# EAGLE design MainBoard 1.5.1 (EAGLE 9.6.2)
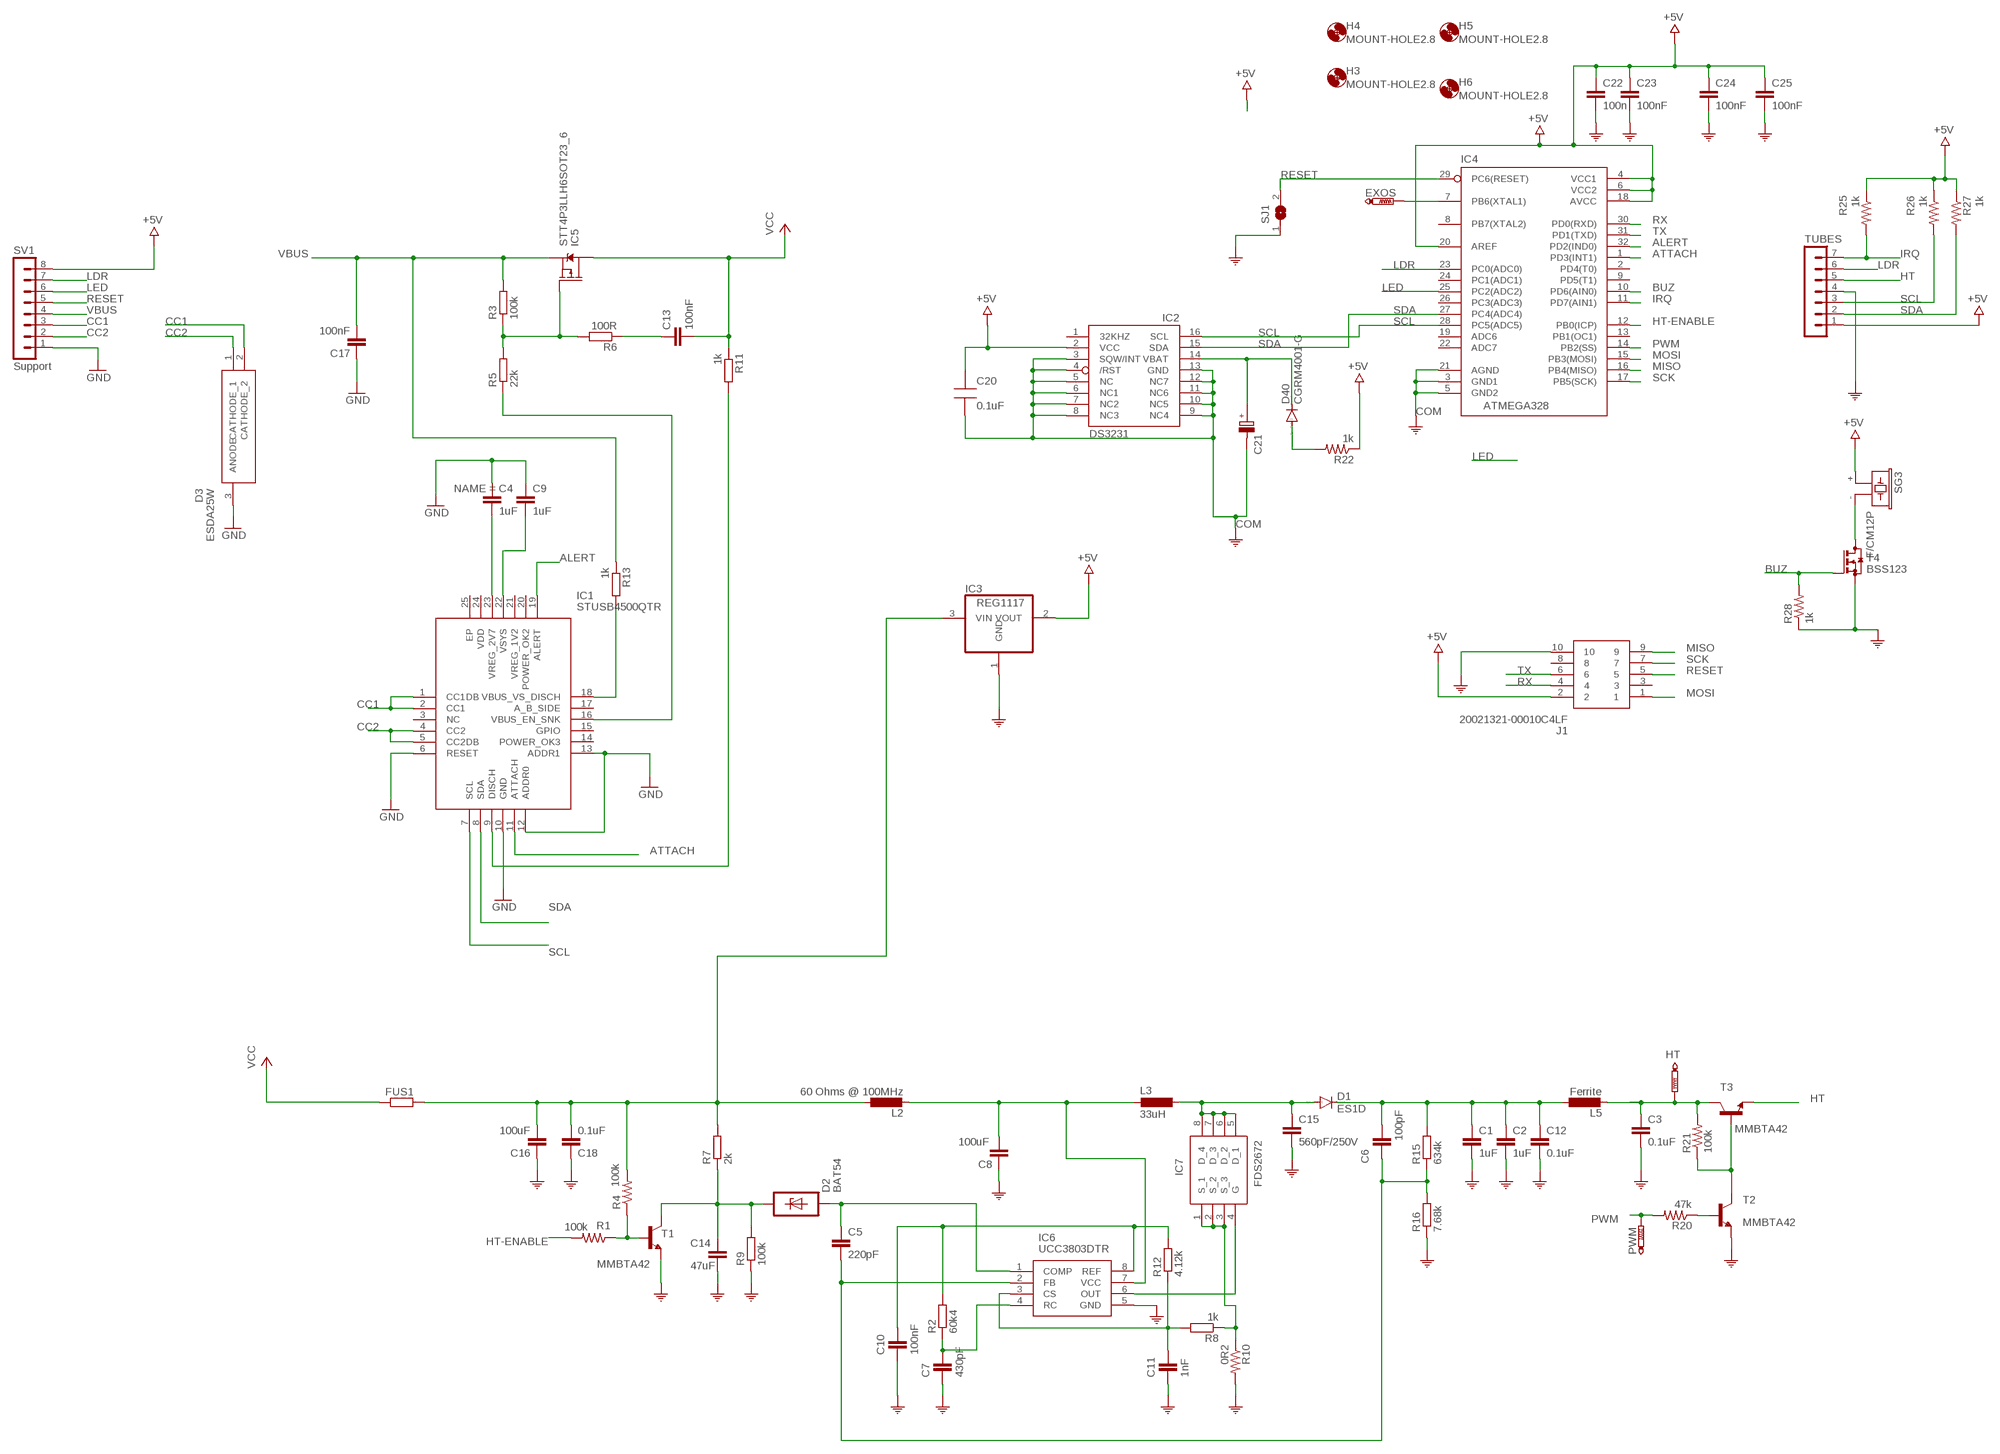
[diagram p0: schematic, sheet 1]

## Parts
C1  1uF  C-EUC1812K  [C1812K]
C2  1uF  C-EUC1812K  [C1812K]
C3  0.1uF  C-EUC1808  [C1808]
C4  1uF  C-EUC0603  [C0603]
C5  220pF  C-EUC0805K  [C0805K]
C6  100pF  C-EUC0805  [C0805]
C7  430pF  C-EUC0805  [C0805]
C8  100uF  C-EUC1210  [C1210]
C9  1uF  C-EUC0603  [C0603]
C10  100nF  C-EUC0805  [C0805]
C11  1nF  C-EUC0805  [C0805]
C12  0.1uF  C-EUC1808  [C1808]
C13  100nF  C-EUC0402  [C0402]
C14  47uF  C-EUC1210  [C1210]
C15  560pF/250V  C-EUC0603  [C0603]
C16  100uF  C-EUC1210  [C1210]
C17  100nF  C-EUC0402  [C0402]
C18  0.1uF  C-EUC0805  [C0805]
C20  0.1uF  CAP0805-NP  [CAP0805-NP]
C21  AHG-35/100-RADIAL  [ELNA21.5X8.0]
C22  100n  C-EUC0603  [C0603]
C23  100nF  C-EUC0603  [C0603]
C24  100nF  C-EUC0603  [C0603]
C25  100nF  C-EUC0603  [C0603]
D1  ES1D  ES2D  [SMB]
D2  BAT54  SP4020-01FTG  [SOD323]
D3  ESDA25W  [SOT65P210X110-3N]
D40  CGRM4001-G  [SOD-123_MINI-SMA]
EXOS  PTR1TP09R  [TP09R]
FUS1  R-EU_R6332  [R6332]
H3  MOUNT-HOLE2.8  [2,8]
H4  MOUNT-HOLE2.8  [2,8]
H5  MOUNT-HOLE2.8  [2,8]
H6  MOUNT-HOLE2.8  [2,8]
HT  PTR1TP09R  [TP09R]
IC1  STUSB4500QTR  [QFN50P400X400X100-25N]
IC2  DS3231/SO  [SO16W]
IC3  REG1117  [SOT223]
IC4  ATMEGA328  ATMEGA168-20AU  [QFP032]
IC5  STT4P3LLH6SOT23_6  [SOT23-6]
IC6  UCC3803DTR  [SOIC127P600X175-8N]
IC7  FDS2672  [SOIC127P600X175-8N]
J1  20021321-00010C4LF  [2002132100010C4LF]
L2  60 Ohms @ 100MHz  L-EUL2012C  [L2012C]
L3  33uH  MSS7341  [MSS7341]
L5  Ferrite  L-EUL2012C  [L2012C]
PWM  PTR1TP09R  [TP09R]
R1  100k  R-US_R0805  [R0805]
R2  60k4  R-EU_R0805  [R0805]
R3  100k  R-EU_R0805  [R0805]
R4  100k  R-US_R0805  [R0805]
R5  22k  R-EU_R0805  [R0805]
R6  100R  R-EU_R0805  [R0805]
R7  2k  R-EU_R0805  [R0805]
R8  1k  R-EU_R0805  [R0805]
R9  100k  R-EU_R0805  [R0805]
R10  0R2  R-US_R2010  [R2010]
R11  1k  R-EU_R0805  [R0805]
R12  4.12k  R-EU_R0805  [R0805]
R13  1k  R-EU_R0805  [R0805]
R15  634k  R-EU_R0805  [R0805]
R16  7.68k  R-EU_R0805  [R0805]
R20  47k  R-US_R2012  [R2012]
R21  100k  R-US_R2012  [R2012]
R22  1k  R-US_M2012  [M2012]
R25  1k  R-US_M2012  [M2012]
R26  1k  R-US_M2012  [M2012]
R27  1k  R-US_M2012  [M2012]
R28  1k  R-US_M2012  [M2012]
SG3  F/CM12P  [F/CM12P]
SJ1  SJW  [SJW]
SV1  Support  MA08-1  [MA08-1]
T1  MMBTA42  BC846  [SOT23]
T2  MMBTA42  BC846  [SOT23]
T3  MMBTA42  BC846  [SOT23]
T4  BSS123  [SOT23]
TUBES  MA07-1  [MA07-1]

## Nets
+5V [pwr]: C20.1 C22.1 C23.1 C24.1 C25.1 IC2.2(VCC) IC3.2(VOUT) IC4.4(VCC1) IC4.6(VCC2) IC4.18(AVCC) IC4.20(AREF) J1.2 R22.1 R25.1 R26.1 R27.1 SG3.+ SV1.8 TUBES.1
ALERT: IC1.19(ALERT) IC4.32(PD2(IND0))
ATTACH: IC1.11(ATTACH) IC4.1(PD3(INT1))
BATT: C21.+ D40.C IC2.14(VBAT)
BUZ: IC4.10(PD6(AIN0)) R28.2 T4.1(G)
CC1: D3.2(CATHODE_2) IC1.1(CC1DB) IC1.2(CC1) SV1.3
CC2: D3.1(CATHODE_1) IC1.4(CC2) IC1.5(CC2DB) SV1.2
COM: C1.2 C2.2 C3.2 C4.1 C7.2 C8.1 C9.1 C10.2 C11.2 C12.2 C14.2 C15.2 C16.1 C17.1 C18.2 C20.2 C21.- C22.2 C23.2 C24.2 C25.2 D3.3(ANODE) IC1.6(RESET) IC1.10(GND) IC1.12(ADDR0) IC1.13(ADDR1) IC2.3(SQW/INT) IC2.4(/RST) IC2.5(NC) IC2.6(NC1) IC2.7(NC2) IC2.8(NC3) IC2.9(NC4) IC2.10(NC5) IC2.11(NC6) IC2.12(NC7) IC2.13(GND) IC3.1(GND) IC4.3(GND1) IC4.5(GND2) IC4.21(AGND) IC6.5(GND) J1.10 R9.1 R10.2 R16.1 R28.1 SJ1.1 SV1.1 T1.2(E) T2.2(E) T4.2(S) TUBES.4 ; supply symbol labelled GND
CS: C11.1 IC6.3(CS) R8.2 R12.1
FB: C5.2 C6.2 IC6.2(FB) R15.1 R16.2
HT: T3.2(E) TUBES.5
HT-ENABLE: IC4.12(PB0(ICP)) R1.2
IRQ: IC4.11(PD7(AIN1)) R25.2 TUBES.7
LDR: IC4.23(PC0(ADC0)) SV1.7 TUBES.6
LED: IC4.25(PC2(ADC2)) SV1.6
MISO: IC4.16(PB4(MISO)) J1.9
MOSI: IC4.15(PB3(MOSI)) J1.1
N$1: C4.2 IC1.23(VREG_2V7)
N$2: C9.2 IC1.22(VSYS)
N$3: SG3.- T4.3(D)
N$5: EXOS.TP IC4.7(PB6(XTAL1))
N$6: C1.1 C2.1 C6.1 C12.1 D1.C L5.1 R15.2
N$7: R21.1 T2.3(C) T3.1(B)
N$8: R1.1 R4.1 T1.1(B)
N$9: C14.1 D2.C R7.1 R9.2 T1.3(C)
N$10: C5.1 D2.A IC6.1(COMP)
N$11: IC5.3(G) R3.1 R5.2 R6.2
N$12: IC7.1(S_1) IC7.2(S_2) IC7.3(S_3) R8.1 R10.1
N$13: C13.1 R6.1
N$14: C8.2 IC6.7(VCC) L2.2 L3.1
N$17: IC1.16(VBUS_EN_SNK) R5.1
N$18: C15.1 D1.A IC7.5(D_1) IC7.6(D_2) IC7.7(D_3) IC7.8(D_4) L3.2
N$19: R20.1 T2.1(B)
N$21: IC1.9(DISCH) R11.2
N$22: IC1.18(VBUS_VS_DISCH) R13.2
N$23: D40.A R22.2
OUT: IC6.6(OUT) IC7.4(G)
POSTFUSE [pwr]: C16.2 C18.1 FUS1.2 IC3.3(VIN) L2.1 R4.2 R7.2
PWM: IC4.14(PB2(SS)) PWM.TP R20.2
RAW_HT: C3.1 HT.TP L5.2 R21.2 T3.3(C)
RC: C7.1 IC6.4(RC) R2.1
REF: C10.1 IC6.8(REF) R2.2 R12.2
RESET: IC4.29(PC6(RESET)) J1.5 SJ1.2 SV1.5
RX: IC4.30(PD0(RXD)) J1.4
SCK: IC4.17(PB5(SCK)) J1.7
SCL: IC1.7(SCL) IC2.16(SCL) IC4.28(PC5(ADC5)) R26.2 TUBES.3
SDA: IC1.8(SDA) IC2.15(SDA) IC4.27(PC4(ADC4)) R27.2 TUBES.2
TX: IC4.31(PD1(TXD)) J1.6
VBUS: C17.2 IC5.4(S) R3.2 R13.1 SV1.4
VCC [pwr]: C13.2 FUS1.1 IC5.1(D) IC5.2(D) IC5.5(D) IC5.6(D) R11.1
Unconnected: IC1.3(NC) IC1.14(POWER_OK3) IC1.15(GPIO) IC1.17(A_B_SIDE) IC1.20(POWER_OK2) IC1.21(VREG_1V2) IC1.24(VDD) IC1.25(EP) IC2.1(32KHZ) IC4.2(PD4(T0)) IC4.8(PB7(XTAL2)) IC4.9(PD5(T1)) IC4.13(PB1(OC1)) IC4.19(ADC6) IC4.22(ADC7) IC4.24(PC1(ADC1)) IC4.26(PC3(ADC3)) J1.3 J1.8

## Library data of the parts
C1 C2 = rcl:C-EU: CAPACITOR, European symbol; MOUSER: 810-C4532X7T2E105MST; SPICEPREFIX: C; TDK: C4532X7T2E105M250KE
C3 C12 = rcl:C-EU: CAPACITOR, European symbol; KEMET: CAN17C104KARACTU; MOUSER: 80-CAN17C104KARACTU; SPICEPREFIX: C
C4 = rcl:C-EU: CAPACITOR, European symbol; MOUSER_PART_NUMBER: 81-GRM155R61E105KA2D; SPICEPREFIX: C
C5 C9 C14 C15 C18 C22-C25 = rcl:C-EU: CAPACITOR, European symbol; SPICEPREFIX: C
C6 C7 C10 C11 = rcl:C-EU: CAPACITOR, European symbol; MOUSER: 791-0603X106K100CT; SPICEPREFIX: C
C8 C16 = rcl:C-EU: CAPACITOR, European symbol; MOUSER: 963-EMK325ABJ107MM-P; SPICEPREFIX: C; TAIYO_YUDEN: EMK325ABJ107MM-P
C13 C17 = rcl:C-EU: CAPACITOR, European symbol; MOUSER_PART_NUMBER: 710-885012205050; SPICEPREFIX: C
C20 = MySMD:CAP0805-NP
C21 = Elkos:AHG-35/100-RADIAL: AUDYN® - AHG Gepolt, radial High Grade AHG Gepolter Elekrolytkondensator für Audio-Netzteile, oder Verstärker im Home- und Car-Bereich. Technische Daten Anschlußdrähte: Kupfer, verzinnt AL: ? mm d2ø : ? mm Kapazitätsbereich: von 10 µF bis 2200 µF Nennspannungen: 25 V, 35 V, 50 V, 100 V C-Toleranz: 20 % ( bei 20° C ) Verlustfaktor: tan δ < 0,100 @ 1 kHz Temperaturbereich: - 40° C bis 85° C Verzerrung: sehr gering bei 10 kHz, 010 A - 120 dB oder niedriger gepolt AHG AUDYN® - AHG gepolt Bezeichnung C U DxH Rm Bestell.-Nr. U / Volt D x L/mm mm AHG/10.0/100V 10µF 100V 10x15 5,0 1341690 AHG/22.0/50V 22µF 50V 10x13 5,0 1341691 AHG/47.0/50V 47µF 50V 10x16 5,0 1341692 AHG/100.0/50V 100µF 50V 13x21 5,0 1341693 AHG/220.0/50V 220µF 50V 16x25 7,5 1341694 AHG/470.0/50V 470µF 50V 16x37 7,5 1341695 AHG/1000/35V 1000µF 35V 18x37 7,5 1341696 AHG/2200/35V 2200µF 35V 22x38 10,0 1341697 Alle Abmessungen in mm; MOUSER: 555-DB-5R5D474T
D1 = diode:ES2D: DIODE super fast rectifier, 2 A
D2 = sp4020_11:SP4020-01FTG: SP4020 Series 2.5pF, 30A Discrete TVS Diode Source: http://www.littelfuse.com/~/media/electronics/datasheets/tvs_diode_arrays/littelfuse_tvs_diode_array_sp4020_datasheet.pdf.pdf; MF: Littelfuse; MPN: SP4020-01FTG; OC_FARNELL: unknown; OC_NEWARK: 05X0400
D3 = SamacSys_Parts:ESDA25W: STMicroelectronics ESDA25W Dual Uni-Directional TVS Diode Array, 400W peak, 3-Pin SOT-323 Source: Datasheet <https://componentsearchengine.com/Datasheets/1/ESDA25W.pdf>; DESCRIPTION: STMicroelectronics ESDA25W Dual Uni-Directional TVS Diode Array, 400W peak, 3-Pin SOT-323; HEIGHT: 1.1mm; MANUFACTURER_NAME: STMicroelectronics; MANUFACTURER_PART_NUMBER: ESDA25W; MOUSER_PART_NUMBER: 511-ESDA25W; MOUSER_PRICE-STOCK: https://www.mouser.com/Search/Refine.aspx?Keyword=511-ESDA25W
D40 = diode:CGRM400*-G: Molded plasitc,JEDEC SOD-123/Mini SMA Source: Comchip CGRM4001-G.pdf; MOUSER: 863-NSR0320MW2T1G
EXOS HT PWM = testpad:PTR1: TEST PIN
FUS1 = rcl:R-EU_: RESISTOR, European symbol; MOUSER: 530-0ZCG0150AF2C; SPICEPREFIX: R
H3-H6 = holes:MOUNT-HOLE: MOUNTING HOLE with drill center marker
IC1 = SamacSys_Parts:STUSB4500QTR: USB Interface IC CONDITIONING & INTERFACES Source: Datasheet <https://componentsearchengine.com/Datasheets/1/STUSB4500QTR.pdf>; DESCRIPTION: USB Interface IC CONDITIONING & INTERFACES; HEIGHT: 1mm; MANUFACTURER_NAME: STMicroelectronics; MANUFACTURER_PART_NUMBER: STUSB4500QTR; MOUSER_PART_NUMBER: 511-STUSB4500QTR; MOUSER_PRICE-STOCK: https://www.mouser.com/Search/Refine.aspx?Keyword=511-STUSB4500QTR
IC2 = DS3231:DS3231; AVAILABILITY: Unavailable; MF: Maxim Integrated; MP: DS3231; PACKAGE: SOIC-16 Maxim Integrated; PRICE: None
IC3 = burr-brown:REG1117: 800mA and 1A Low Dropout (LDO) Positive Regulator 1.8V, 2.5V, 2.85V, 3.3V, 5V, and Adj; MPN: REG1117; OC_FARNELL: 1097566; OC_NEWARK: 14P6981
IC4 = MySMD:ATMEGA168-20AU
IC5 = STT4P3LLH6:STT4P3LLH6; AVAILABILITY: Unavailable; DESCRIPTION: P-Channel 30 V, 0.048 Ohm typ., 4 A STripFET H6 Power MOSFET in a SOT23-6L package; MF: STMicroelectronics; MP: STT4P3LLH6; PACKAGE: SOT-23-6 STMicroelectronics; PRICE: None
IC6 = UCC3803DTR:UCC3803DTR: Switching Controllers Low-Power BiCMOS Current-Mode PWM Source: Datasheet <http://www.ti.com/lit/ds/symlink/ucc3803.pdf>; DESCRIPTION: Switching Controllers Low-Power BiCMOS Current-Mode PWM; HEIGHT: 1.75mm; MANUFACTURER_NAME: Texas Instruments; MANUFACTURER_PART_NUMBER: UCC3803DTR; MOUSER_PART_NUMBER: 595-UCC3803DTR; MOUSER_PRICE-STOCK: https://www.mouser.com/Search/Refine.aspx?Keyword=595-UCC3803DTR
IC7 = FDS2672:FDS2672: FDS2672, N-channel MOSFET Transistor 3.9 A 200 V, 8-Pin SOIC Source: Datasheet <http://docs-emea.rs-online.com/webdocs/0d23/0900766b80d23481.pdf>; DESCRIPTION: FDS2672, N-channel MOSFET Transistor 3.9 A 200 V, 8-Pin SOIC; HEIGHT: 1.75mm; MANUFACTURER_NAME: Fairchild Semiconductor; MANUFACTURER_PART_NUMBER: FDS2672; MOUSER_PART_NUMBER: 512-FDS2672; MOUSER_PRICE-STOCK: https://www.mouser.com/Search/Refine.aspx?Keyword=512-FDS2672; RS_PART_NUMBER: 6710481P; RS_PRICE-STOCK: http://uk.rs-online.com/web/p/products/6710481P
J1 = SamacSys_Parts:20021321-00010C4LF: Headers & Wire Housings 1.27x1.27mm BTB, Hdr Recept, SMT, 10 Pos Source: Datasheet <https://componentsearchengine.com/Datasheets/1/20021321-00010C4LF.pdf>; DESCRIPTION: Headers & Wire Housings 1.27x1.27mm BTB, Hdr Recept, SMT, 10 Pos; HEIGHT: 4.75mm; MANUFACTURER_NAME: Amphenol; MANUFACTURER_PART_NUMBER: 20021321-00010C4LF; MOUSER_PART_NUMBER: 649-202132100010C4LF; MOUSER_PRICE-STOCK: https://www.mouser.com/Search/Refine.aspx?Keyword=649-202132100010C4LF
L2 L5 = rcl:L-EU: INDUCTOR, European symbol; SPICEPREFIX: L
L3 = STEAM-inductor-coilcraft:MSS7341: Shielded Power Inductors Package 6.6 × 6.6 mm x 4.1 mm high Source: http://www.farnell.com/datasheets/1681958.pdf; MOUSER: 710-784770330
R1 R4 R10 R20-R22 R25-R28 = adafruit:R-US_: RESISTOR, American symbol
R2 R3 R5 R6 R8 R9 R11 R13 = rcl:R-EU_: RESISTOR, European symbol; SPICEPREFIX: R
R7 = rcl:R-EU_: RESISTOR, European symbol; MOUSER: 754-RR1220P-202D; SPICEPREFIX: R; SUSUMU: RR1220P-202-D
R12 = rcl:R-EU_: RESISTOR, European symbol; KOASPEER: RN732ATTD4121F100; MOUSER: 660-RN732ATD4121F100; SPICEPREFIX: R
R15 = rcl:R-EU_: RESISTOR, European symbol; MOUSER: 71-CRCW0603-634K-E3; SPICEPREFIX: R; VISHAY: CRCW0603634KFKEA
R16 = rcl:R-EU_: RESISTOR, European symbol; MOUSER: 71-CRCW0805-7.68K-E3; SPICEPREFIX: R; VISHAY: CRCW08057K68FKEA
SG3 = buzzer:F/CM12P: BUZZER Source: Buerklin; OC_FARNELL: unknown; OC_NEWARK: unknown
SJ1 = jumper:SJ: SMD solder JUMPER
SV1 = con-lstb:MA08-1: PIN HEADER; OC_FARNELL: unknown; OC_NEWARK: unknown
T1-T3 = transistor:BC846: NPN TRANSISTOR
T4 = transistor-small-signal:BSS123: N-CHANNEL MOS FET
TUBES = con-lstb:MA07-1: PIN HEADER; OC_FARNELL: unknown; OC_NEWARK: unknown

## Module TUBEIN16
Ports: 

### Library data of the parts

## Net classes
0 default: width 0.254 mm, clearance 0.254 mm
1 pwr: width 0.254 mm, clearance 0.356 mm

## Board
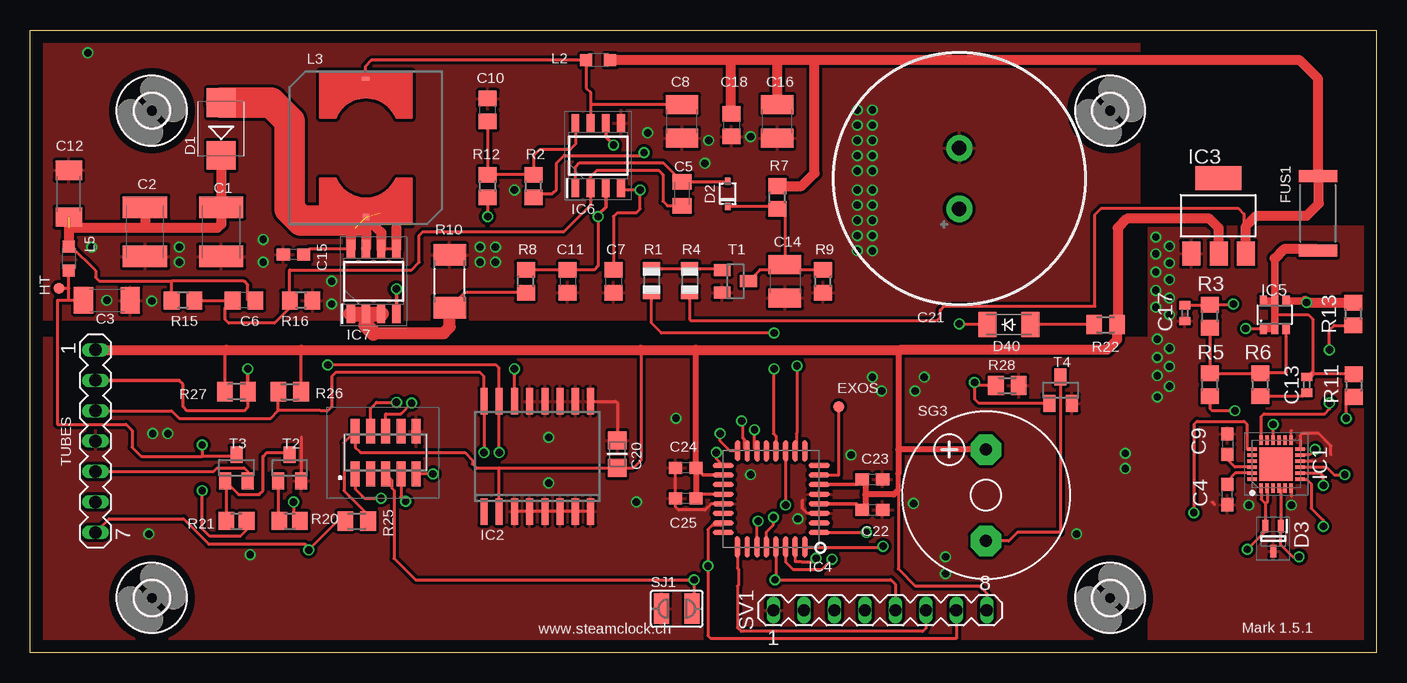
[diagram p1: board, top side]
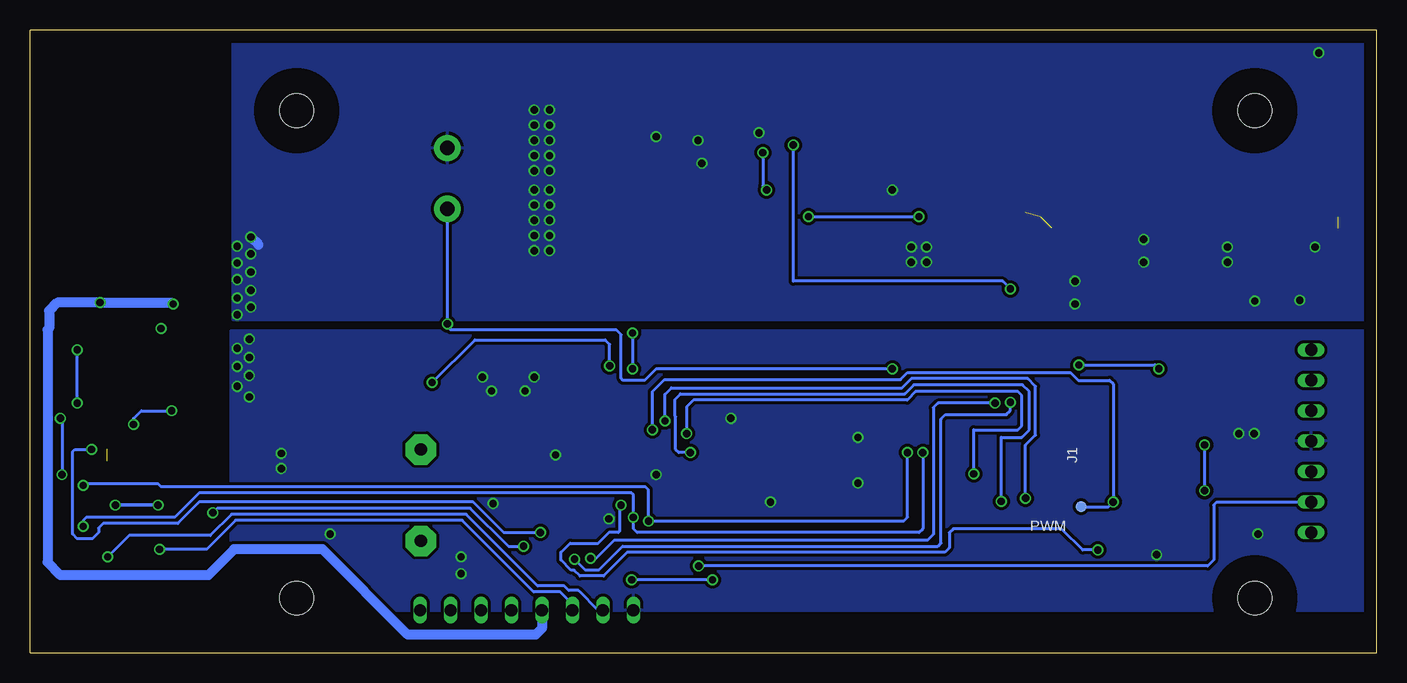
[diagram p2: board, bottom side, seen from below]

Size 112.27 x 51.94 mm. Coordinates in mm from the lower left corner, seen from the top.
Outline: 0,51.94 112.27,51.94 112.27,0 0,0 0,51.94
Copper layers (1*16): Top 0.035mm / dielectric 1.5mm / Bottom 0.035mm
Design rules "default *": minimum track width 10mil, minimum drill 24mil, track to track 8mil, track to pad 8mil, pad to pad 8mil, via to via 8mil, smd to smd 8mil, copper to edge 40mil, drill to drill 8mil, minimum pad ring 1mil, minimum via ring 3mil, stop-mask expansion 4mil, vias tented up to drill 0mil, thermal gap 10mil

### Footprints (pad centres in the part's own frame; a part is rotated, then mirrored left to right if it is on the bottom)
C1812K = smd 1.8 x 3.7: 1 -2.05,0; 2 2.05,0
C1808 = smd 1.6 x 2.2: 1 -1.95,0; 2 1.95,0
C0603 = smd 1.1 x 1: 1 -0.85,0; 2 0.85,0
C0805K = smd 1.3 x 1.6: 1 -1,0; 2 1,0
C0805 = smd 1.3 x 1.5: 1 -0.95,0; 2 0.95,0
C1210 = smd 1.6 x 2.7: 1 -1.4,0; 2 1.4,0
C0402 = smd 0.7 x 0.9: 1 -0.65,0; 2 0.65,0
CAP0805-NP = smd 1.524 x 1.524: 1 0,0; 2 2.286,0
ELNA21.5X8.0 = drill 1.2 pad 2.184: + -2.54,0; - 2.54,0
SMB = smd 2.4 x 2.4: A 2.2,0; C -2.2,0
SOD323 = smd 0.6 x 0.45: A 1.06,0; C -1.06,0
SOT65P210X110-3N = smd 1.05 x 0.5: 1 -1.05,0.65; 2 -1.05,-0.65; 3 1.05,0
SOD-123_MINI-SMA = smd 1.5 x 2.1: A 1.8,0; C -1.8,0
TP09R = smd 0.9 x 0.9: TP 0,0
R6332 = smd 1 x 3.2: 1 -3.1,0; 2 3.1,0
2,8 = hole 2.8: 0,0
QFN50P400X400X100-25N = smd 0.8 x 0.3: 1 -2,1.25; 2 -2,0.75; 3 -2,0.25; 4 -2,-0.25; 5 -2,-0.75; 6 -2,-1.25; 13 2,-1.25; 14 2,-0.75; 15 2,-0.25; 16 2,0.25; 17 2,0.75; 18 2,1.25 | smd 0.3 x 0.8: 7 -1.25,-2; 8 -0.75,-2; 9 -0.25,-2; 10 0.25,-2; 11 0.75,-2; 12 1.25,-2; 19 1.25,2; 20 0.75,2; 21 0.25,2; 22 -0.25,2; 23 -0.75,2; 24 -1.25,2 | smd 2.8 x 2.8: 25 0,0
SO16W = smd 0.6 x 2.2: 1 -4.445,-4.6; 2 -3.175,-4.6; 3 -1.905,-4.6; 4 -0.635,-4.6; 5 0.635,-4.6; 6 1.905,-4.6; 7 3.175,-4.6; 8 4.445,-4.6; 9 4.445,4.6; 10 3.175,4.6; 11 1.905,4.6; 12 0.635,4.6; 13 -0.635,4.6; 14 -1.905,4.6; 15 -3.175,4.6; 16 -4.445,4.6
SOT223 = smd 1.499 x 2.007: 1 -2.261,-3.15; 2 0.025,-3.15; 3 2.311,-3.15 | smd 3.81 x 2.007: 4 0,3.15
QFP032 = smd 0.432 x 1.778: 1 0,0; 2 0.8,0; 3 1.599,0; 4 2.399,0; 5 3.199,0; 6 3.998,0; 7 4.798,0; 8 5.598,0; 17 5.588,8.001; 18 4.798,7.997; 19 3.998,7.997; 20 3.199,7.997; 21 2.399,7.997; 22 1.599,7.997; 23 0.799,7.997; 24 0,7.997 | smd 1.778 x 0.432: 9 6.807,1.194; 10 6.807,2.007; 11 6.807,2.794; 12 6.807,3.607; 13 6.807,4.394; 14 6.807,5.182; 15 6.807,5.994; 16 6.816,6.803; 25 -1.194,6.807; 26 -1.194,5.994; 27 -1.194,5.182; 28 -1.194,4.394; 29 -1.194,3.607; 30 -1.194,2.794; 31 -1.194,2.007; 32 -1.194,1.194
SOT23-6 = smd 0.6 x 0.9: 1 -0.95,-1.15; 2 0,-1.15; 3 0.95,-1.15; 4 0.95,1.15; 5 0,1.15; 6 -0.95,1.15
SOIC127P600X175-8N = smd 1.525 x 0.65: 1 -2.712,1.905; 2 -2.712,0.635; 3 -2.712,-0.635; 4 -2.712,-1.905; 5 2.712,-1.905; 6 2.712,-0.635; 7 2.712,0.635; 8 2.712,1.905
SOIC127P600X175-8N' = smd 1.525 x 0.7: 1 -2.712,1.905; 2 -2.712,0.635; 3 -2.712,-0.635; 4 -2.712,-1.905; 5 2.712,-1.905; 6 2.712,-0.635; 7 2.712,0.635; 8 2.712,1.905
2002132100010C4LF = smd 0.76 x 2.05: 1 2.54,1.775; 2 2.54,-1.775; 3 1.27,1.775; 4 1.27,-1.775; 5 0,1.775; 6 0,-1.775; 7 -1.27,1.775; 8 -1.27,-1.775; 9 -2.54,1.775; 10 -2.54,-1.775
L2012C = smd 1 x 1: 1 -1,0; 2 1,0
MSS7341 = smd 0.61 x 0.305: 1 0,5.765 | smd 0.5 x 0.5: 2 0,-5.765
R0805 = smd 1.1 x 1.4: 1 -1,0; 2 1,0
R0805' = smd 1.3 x 1.5: 1 -0.95,0; 2 0.95,0
R2010 = smd 1.8 x 2.7: 1 -2.2,0; 2 2.2,0
R2012 = smd 1.3 x 1.5: 1 -0.85,0; 2 0.85,0
M2012 = smd 1.3 x 1.6: 1 -0.95,0; 2 0.95,0
F/CM12P = drill 1.016 pad 2.54 octagon: + 3.81,0; - -3.81,0
SJW = smd 1.27 x 2.54: 1 -1.27,0; 2 1.27,0
MA08-1 = drill 1.016 long: 1 -8.89,0; 2 -6.35,0; 3 -3.81,0; 4 -1.27,0; 5 1.27,0; 6 3.81,0; 7 6.35,0; 8 8.89,0
SOT23 = smd 1 x 1.4: 1 -0.95,-1.1; 2 0.95,-1.1; 3 0,1.1
MA07-1 = drill 1.016 long: 1 -7.62,0; 2 -5.08,0; 3 -2.54,0; 4 0,0; 5 2.54,0; 6 5.08,0; 7 7.62,0

### Placement (x,y rotation side)
C1  15.94,35.12 270 top
C2  9.59,35.12 270 top
C3  6.41,29.4 0 top
C4  99.82,13.21 90 top
C5  54.36,38.29 270 top
C6  17.84,29.4 180 top
C7  48.64,30.99 270 top
C8  54.36,44.32 90 top
C9  99.82,17.4 270 top
C10  38.16,45.28 90 top
C11  44.83,30.99 270 top
C12  3.24,38.29 90 top
C13  106.43,22.35 90 top
C14  62.93,30.99 270 top
C15  21.97,33.21 180 top
C16  62.29,44.32 90 top
C17  96.27,28.32 90 top
C18  58.48,44.01 270 top
C20  48.96,15.43 90 top
C21  77.47,39.56 90 top
C22  70.23,11.94 0 top
C23  70.23,14.48 0 top
C24  54.67,15.43 180 top
C25  54.67,12.89 180 top
D1  15.94,43.69 90 top
D2  58.17,38.29 90 top
D3  103.63,9.53 270 top
D40  81.6,27.37 0 top
EXOS  67.44,20.51 0 top
FUS1  107.38,36.64 90 top
H3  10.16,45.21 0 top
H4  10.16,4.57 0 top
H5  90.04,4.57 0 top
H6  90.04,45.21 0 top
HT  2.41,30.42 0 top
IC1  103.89,15.75 90 top
IC2  42.29,16.38 0 top
IC3  99.06,36.45 0 top
IC4  65.79,10.03 90 top
IC5  103.76,28.19 0 top
IC6  47.37,41.47 90 top
IC7  FDS2672  [SOIC127P600X175-8N']  28.64,30.99 90 top
J1  29.65,16.7 180 top
L2  47.37,49.4 180 top
L3  28,42.1 0 top
L5  3.24,32.89 270 top
PWM  24.64,12.19 0 bottom
R1  51.82,31.04 270 top
R2  60k4  [R0805']  41.97,38.93 90 top
R3  100k  [R0805']  98.36,28.07 90 top
R4  54.99,31.04 270 top
R5  22k  [R0805']  98.36,22.35 90 top
R6  100R  [R0805']  102.55,22.35 90 top
R7  2k  [R0805']  62.29,37.97 90 top
R8  1k  [R0805']  41.34,30.99 90 top
R9  100k  [R0805']  66.1,30.99 90 top
R10  34.99,30.99 90 top
R11  1k  [R0805']  110.36,22.29 270 top
R12  4.12k  [R0805']  38.16,38.93 90 top
R13  1k  [R0805']  110.3,28.26 270 top
R15  634k  [R0805']  12.76,29.4 180 top
R16  7.68k  [R0805']  22.61,29.4 180 top
R20  21.65,10.99 0 top
R21  17.21,10.99 0 top
R22  89.66,27.37 180 top
R25  27.24,10.99 180 top
R26  21.65,21.78 180 top
R27  17.21,21.78 0 top
R28  81.47,22.29 180 top
SG3  79.69,13.14 90 top
SJ1  53.91,3.68 0 top
SV1  70.87,3.56 0 top
T1  58.8,30.99 270 top
T2  21.65,15.43 0 top
T3  17.21,15.43 0 top
T4  85.92,21.91 0 top
TUBES  5.46,17.65 270 top

### Tracks (layer width: path | path; a pad name or v marks a point on that pad's centre or on a via)
+5V
  Top 0.254: 39.12,15.43 37.21,15.43 36.89,15.75 36.89,16.07 36.26,16.7 27.56,16.7 27.11,17.14 J1.2 26.17,17.53 26.17,13.51 28.19,11.49 R25.1 | 39.12,15.43 C20.1 50.29,15.43 50.93,16.07 50.93,25.27 | IC2.2 39.12,15.43 | 99.08,35.18 99.08,35.43 | IC4.20 55.87,13.23 C25.1 | 22.61,25.27 22.6,25.27 R26.1 | 16.38,25.27 16.26,25.15 R27.1 | 55.52,25.25 55.5,25.27 | C23.1 69.64,14.22 | 72.64,25.27 72.39,25.02 | SV1.8 79.76,4.95 79.12,5.59 73.79,5.59 72.39,6.99 72.39,13.59
  Top 0.305: IC4.4 68.89,12.43 C22.1 69.64,12.19 | IC4.6 68.93,14.03 C23.1 | IC4.18 56.12,14.83 C24.1
  Top 0.406: 72.39,13.59 72.39,14.92
  Top 0.508: C25.1 C24.1 55.52,25.25 | 69.64,13.21 69.64,12.19 | 69.64,14.22 69.64,13.21 | 72.39,25.02 72.39,16.95 | 72.39,16.95 72.39,14.92 | 72.39,13.59 72.01,13.21 69.64,13.21 | SG3.+ 72.39,16.95
  Top 0.813: IC3.2 99.08,35.18 | 99.08,35.43 98.32,36.2 91.44,36.2 90.68,35.43 90.68,27.43 R22.1 90.61,26.1 89.79,25.27 72.64,25.27 55.5,25.27 50.93,25.27 22.61,25.27 16.38,25.27 TUBES.1
ALERT  (via drill 0.61)
  Top 0.254: IC4.32 64.59,8.76 70.99,8.76 v71.12,8.89 | IC1.19 101.47,17 101.47,19.05 101.22,19.3 97.28,19.3 97.03,19.05 v97.03,11.68
  Bottom 0.254: v71.12,8.89 72.39,8.89 75.56,12.06 96.65,12.06 v97.03,11.68
ATTACH  (via drill 0.61)
  Top 0.254: IC4.1 v69.72,10.03 | v107.13,16.96 106.67,16.51 IC1.11
  Bottom 0.254: v107.13,16.96 108.53,16.96 108.71,16.78 108.71,9.91 108.33,9.53 107.06,9.53 106.55,10.03 106.55,10.41 106.17,10.79 99.95,10.79 98.17,12.57 75.31,12.57 72.77,10.03 v69.72,10.03
BATT  (via drill 0.61)
  Top 0.254: IC2.14 v40.39,23.69 | D40.C 77.47,27.37 v77.47,27.43
  Bottom 0.254: v40.39,23.69 60.07,23.69 61.02,22.73 62.87,22.73 62.99,22.86 62.99,26.54 63.37,26.92 77.22,26.92 77.47,27.18 v77.47,27.43 C21.+
BUZ  (via drill 0.61)
  Top 0.254: IC4.10 63.88,16.94 63.88,18.29 63.94,18.35 v63.94,23.94 | T4.1 79.12,20.81 78.74,21.19 v78.74,22.54 78.99,22.29 R28.2
  Bottom 0.254: v78.74,22.54 75.18,26.1 64.33,26.1 63.94,25.72 v63.94,23.94
CC1  (via drill 0.61)
  Top 0.254: IC1.1 102.64,12.81 103,12.45 | IC1.2 103.14,12.59 103,12.45 | 103,12.45 103,10.59 D3.2 102.98,10.14 v101.47,8.64
  Bottom 0.254: SV1.3 67.06,4.06 68.07,5.08 70.27,5.08 76.24,11.05 95.12,11.05 97.54,8.64 v101.47,8.64
CC2  (via drill 0.61)
  Top 0.254: 104.28,13.39 104.28,13.6 IC1.4 | IC1.5 104.28,13.39 | 104.28,13.39 D3.1 104.28,9 105.28,8 v105.79,8
  Bottom 0.254: SV1.2 64.9,3.56 66.55,5.21 67.35,5.21 67.73,5.59 69.94,5.59 75.91,11.56 95.46,11.56 97.24,9.78 104.01,9.78 v105.79,8
COM  (via drill 0.61)  (1 unrouted)
  Top 0.254: IC4.3 64.82,11.63 64.41,12.04 64.41,12.72 | IC2.8 IC2.7 IC2.6 IC2.5 IC2.4 IC2.3 | IC4.21 56.8,12.43 56.27,11.91 54.07,11.91 53.82,12.15 C25.2 C24.2 | IC2.9 48.8,20.98 48.96,20.83 C20.2 | 22.61,17.97 T2.2 | 98.77,12.36 98.55,12.57 | 108.46,16.51 108.46,17.27 107.44,18.29 106.05,18.29 105.89,18.13 105.89,17.03 | IC1.10 106.93,16 | IC1.13 105.14,18.52 105.16,18.54 | IC1.6 105.16,13.73 105.16,13.08
  Top 0.305: 101.43,12.36 101.47,12.32 v101.6,12.32
  Bottom 0.305: v101.6,12.32 v105.16,12.32
  Bottom 0.813: v93.85,34.67 93.22,34.04
  other vias: 10.22,18.29 11.49,18.29 18.35,8.19 9.91,9.91 4.83,50.04 19.43,32.58 12.45,32.58 6.41,29.4 5.14,33.85 12.45,33.85 19.43,34.48 37.53,33.85 37.53,32.58 38.8,32.58 38.8,33.85 25.15,30.99 25.15,29.08 70.23,33.53 70.23,34.8 70.23,36.07 70.23,37.34 70.23,38.61 70.23,40.2 70.23,41.47 70.23,42.74 70.23,44.01 70.23,45.28 68.96,33.53 68.96,34.8 68.96,36.07 68.96,37.34 68.96,38.61 68.96,40.2 68.96,41.47 68.96,42.74 68.96,44.01 68.96,45.28 43.24,17.97 43.24,14.16 50.55,12.57 51.5,43.37 56.58,42.74 56.26,40.83 60.07,43.05 40.39,38.61 95,29.59 95,33.91 95,31.11 95,32.51 95,28.19 93.85,33.27 93.85,31.75 93.85,30.23 93.85,28.83 76.33,8 76.33,6.6 91.31,16.64 91.31,15.37 60.07,14.86 64.01,11.18 53.85,19.56 10.16,29.34 93.98,26.16 95,25.4 93.98,24.64 95,23.88 93.98,23.11 95,22.23 93.98,21.34 68.45,16.51 70.23,22.99 70.99,21.84 73.79,21.84 74.55,22.99 73.66,12.45 87.25,9.91
  pour Top: 0.38,50.99 92.46,50.99 92.46,27.81 0.38,27.81
  pour Bottom: -2.16,26.86 -2.16,3.49 95.5,3.49 95.5,26.86
  pour Top: -1.84,26.23 -1.84,0.25 93.47,0.25 93.47,26.23
  pour Bottom: 95.38,50.99 95.38,27.81 0.38,27.81 0.38,50.99
  pour Top: 93.28,35.5 93.28,-0.38 111.25,-0.38 111.25,35.5
CS  (via drill 0.61)
  Top 0.254: R12.1 v38.16,36.39 | v47.37,36.39 47.37,32.26 47.05,31.94 C11.1 R8.2
  Top 0.305: IC6.3 48.01,37.17 47.37,36.53 v47.37,36.39
  Bottom 0.254: v47.37,36.39 v38.16,36.39
FB
  Top 0.254: C5.2 53.13,37.29 52.77,37.66 52.77,39.88 52.45,40.2 47.23,40.2 46.74,39.71 IC6.2 46.74,37.34 44.51,35.12 32.77,35.12 32.45,34.8 32.45,32.58 31.81,31.94 21.66,31.94 R16.2 21.66,28.77 20.38,27.5 16.57,27.5 16.26,27.81 16.26,28.76 C6.2 R15.1
HT
  Top 0.254: TUBES.5 15.3,15.11 15.6,15.41 17.82,15.41 17.84,15.43 18.16,15.12 T3.2
HT-ENABLE  (via drill 0.61)
  Top 0.254: IC4.12 62.18,18.07 61.97,18.28 61.98,18.29 61.98,23.62 v62.04,23.69 | v62.04,26.67 52.64,26.67 51.82,27.5 R1.2
  Bottom 0.254: v62.04,26.67 v62.04,23.69
IRQ  (via drill 0.61)
  Top 0.254: R25.2 25.65,10.99 v23.24,8.57 23.24,8.76 22.92,9.08 14.86,9.08 14.86,9.12 12.81,11.18 6.6,11.18 TUBES.7 | IC4.11 v62.99,12.32
  Bottom 0.254: v23.24,8.57 24.51,8.57 26.29,10.35 35.31,10.35 35.62,10.03 35.62,8.76 36.01,8.38 62.48,8.38 64.45,6.41 66.42,6.41 66.9,6.89 67.15,6.89 68.01,7.75 68.01,8.38 67.25,9.14 64.9,9.14 64.01,10.03 63.25,10.03 63.12,10.16 63.12,12.19 v62.99,12.32
LDR  (via drill 0.61)
  Top 0.254: SV1.7 77.22,1.18 56.77,1.18 56.52,1.43 v56.52,7.24 56.52,10.28 56.87,10.63 57.59,10.63 IC4.23
  Bottom 0.254: TUBES.6 13.34,12.57 13.59,12.32 13.59,7.75 14.1,7.24 v56.52,7.24
LED
  Top 0.254: SV1.6 74.68,2.03 74.42,1.78 59.31,1.78 58.98,2.11 58.98,5.55 59.05,5.63 59.05,6.99 58.98,7.06 IC4.25
MISO  (via drill 0.61)
  Top 0.254: v33.59,14.92 v33.59,14.93 J1.9 | IC4.16 58.34,16.85 57.53,17.65 v57.53,18.29
  Bottom 0.254: v33.59,14.92 33.59,18.61 29.91,18.61 29.59,18.92 29.59,21.46 29.91,21.78 38.44,21.78 39.14,21.08 56.96,21.08 57.53,20.51 v57.53,18.29
MOSI  (via drill 0.61)
  Top 0.254: J1.1 27.11,13.65 27.88,12.89 v29.27,12.89 | IC4.15 59.58,17.05 59.58,17.77 59.44,17.91 59.44,19.24 v59.33,19.34
  Bottom 0.254: v29.27,12.89 29.27,17.34 28.45,18.16 28.45,22.23 29.08,22.86 38.8,22.86 39.56,22.1 58.8,22.1 59.33,21.57 v59.33,19.34
N$1
  Top 0.254: C4.2 99.82,14.32 100.48,15 IC1.23
N$2
  Top 0.254: IC1.22 100.45,15.5 99.82,16.13 C9.2
N$3
  Top 0.254: SG3.- 81.6,9.34 82.3,10.03 85.92,10.03 T4.3
N$5
  Top 0.254: IC4.7 67.44,14.83 EXOS.TP
N$6  (1 unrouted)
  Top 0.254: C6.1 18.16,29.4 18.16,30.67 17.84,30.99 11.81,30.99 | R15.2 11.81,30.99 | L5.1 3.44,33.89 5.46,31.88 5.46,31.3 5.78,30.99 11.81,30.99
  Top 0.813: D1.C C1.1 15.94,35.75 15.62,35.43 9.59,35.43 | 9.59,35.43 3.24,35.43 | C2.1 9.59,35.43 | C12.1 L5.1
N$7
  Top 0.254: T2.3 21.48,16.7 19.75,16.7 19.43,16.38 19.43,13.53 19.11,13.21 17.38,13.21 T3.1 16.36,14.23 R21.1
N$8
  Top 0.254: T1.1 57.6,32.03 R4.1 R1.1
N$9
  Top 0.254: D2.C 62.09,37.23 R7.1 62.93,36.39 C14.1 63.38,31.94 R9.2 60.85,31.94 T1.3
N$10
  Top 0.254: IC6.1 45.47,40.51 45.78,40.83 52.82,40.83 C5.1 58.11,39.29 D2.A
N$11
  Top 0.254: R3.1 R5.2 R6.2 102.62,23.37 104.71,23.37 IC5.3
N$12
  Top 0.254: R8.1 36.24,30.04 R10.1
  Top 1.016: 28.64,26.67 34.48,26.67 34.99,27.18 R10.1
  Top 1.27: IC7.1 IC7.2 | IC7.2 IC7.3 | 28.64,26.67 28,27.3 IC7.2
N$13
  Top 0.254: R6.1 106.13,21.4 C13.1
N$14
  Top 0.254: 46.74,45.72 46.74,46.74 46.37,47.1 L2.2 28.45,49.4 27.94,48.9 27.94,47.93 L3.1 | 46.74,45.72 IC6.7 | C8.2 46.74,45.72
N$17  (via drill 0.61)
  Top 0.254: R5.1 98.36,20.38 98.55,20.19 v100.46,20.19 | IC1.16 v103.64,19.05 v103.63,19.05
  Bottom 0.254: v103.63,19.05 103.63,19.56 103,20.19 v100.46,20.19
N$18  (2 unrouted)
  Top 0.254: C15.1 23.31,33.7 IC7.8 | L3.2 27.74,36.07 27.37,36.07 28,35.43 | 27.1,35.43 26.73,35.43 | IC7.6 IC7.5
  Top 0.813: 29.27,36.7 29.59,37.02 | 28,35.43 IC7.7 | L3.2 29.27,35.07 IC7.6 | IC7.5 30.54,35.43 | 26.73,35.43 IC7.8
  Top 2.54: D1.A 20.09,45.89 21.65,44.32 21.65,37.02 22.61,36.07 27.37,36.07
N$19
  Top 0.254: R20.1 20.7,11.09 T2.1
N$21  (via drill 0.61)
  Top 0.254: IC1.9 108.07,15.5 108.71,14.86 v109.6,14.86 | v109.73,19.56 109.73,20.7 R11.2
  Bottom 0.254: v109.6,14.86 109.6,19.43 v109.73,19.56
N$22  (via drill 0.61)
  Top 0.254: IC1.18 102.64,19.7 102.87,19.94 107.95,19.94 108.33,20.32 v108.33,20.83 | v108.33,25.27 108.33,26.92 108.72,27.31 R13.2
  Bottom 0.254: v108.33,20.83 v108.33,25.27
N$23
  Top 0.254: R22.2 D40.A
OUT  (via drill 0.61)
  Top 0.254: 30.54,30.04 v30.54,30.35
  Top 0.305: IC7.4 30.54,30.04 | IC6.6 48.01,42.99 v48.64,42.35
  Bottom 0.254: v30.54,30.35 31.18,30.99 48.64,30.99 v48.64,42.35
POSTFUSE
  Top 0.254: 107.44,39.8 FUS1.2 | R4.2 54.99,27.81 55.12,27.69 75.56,27.69 75.89,28.02 75.89,28.6 76.2,28.91 88.77,28.91 88.77,36.56 89.29,37.08 100.72,37.08 101.21,36.6 101.21,33.47 IC3.3
  Top 0.813: FUS1.2 107.38,47.88 105.86,49.4 65.41,49.4 | IC3.3 101.37,35.59 102.23,36.45 106.43,36.45 107.44,37.47 107.44,39.8 | 65.41,49.4 62.36,49.4 | 62.36,49.4 58.42,49.4 | 58.42,49.4 L2.1 | C18.1 58.42,45.02 58.42,49.4 | C16.2 62.29,49.34 62.36,49.4 | R7.2 64.32,38.92 65.41,40.01 65.41,49.4
PWM  (via drill 0.61)
  Top 0.254: v60.39,18.61 60.39,17.06 IC4.14 | R20.2 21.97,11.52 v21.97,12.57
  Bottom 0.254: PWM.TP 22.35,12.19 v21.97,12.57 21.97,22.42 22.29,22.73 24.89,22.73 25.53,23.37 39.12,23.37 39.69,22.8 59.37,22.8 60.39,21.78 v60.39,18.61
RAW_HT  (via drill 0.61)
  Top 0.254: T3.3 17.06,16.38 14.35,16.38 | 3.24,29.4 3.24,30.42 | C3.1 3.24,29.4 | 3.24,29.4 2.29,29.4 2.29,19.05 8,19.05 8.51,18.54 8.51,17.14 9.27,16.38 14.35,16.38 | R21.2 18.06,10.25 17.53,9.72 14.99,9.72 14.35,10.35 v14.35,13.53 | v14.35,17.34 14.35,16.38 | HT.TP 3.24,30.42 | 3.24,30.42 L5.2
  Bottom 0.254: v14.35,13.53 v14.35,17.34
RC  (via drill 0.61)
  Top 0.254: IC6.4 49.28,38.61 v50.86,38.61 50.86,37.02 50.55,36.7 48.96,36.7 48.64,36.39 C7.1 | R2.1 42.29,38.29 43.56,38.29 43.88,38.61 43.88,40.83 44.51,41.47 51.18,41.47 v51.18,41.72
  Bottom 0.254: v51.18,41.72 51.18,38.92 v50.86,38.61
REF
  Top 0.254: C10.1 R12.2 R2.2 41.97,41.46 42.48,41.97 45.02,41.97 45.47,42.42 IC6.8
RESET  (via drill 0.61)
  Top 0.254: SV1.5 72.14,5.71 71.75,6.1 v62.1,6.1 62.18,6.17 IC4.29 | SJ1.2 55.31,3.68 55.31,3.63 55.37,3.68 v55.37,6.1 32.13,6.1 30.35,7.87 30.35,13.55 30.16,13.74 30.16,14.42 J1.5
  Bottom 0.254: v55.37,6.1 v62.1,6.1
RX  (via drill 0.61)
  Top 0.254: v30.54,20.89 28.89,20.89 28.38,20.38 J1.4 | IC4.30 62.99,7.57 63.63,6.93 65.99,6.93 v66.86,7.81
  Bottom 0.254: v66.86,7.81 65.98,6.92 64.83,6.92 62.87,8.89 36.6,8.89 36.32,9.17 36.32,19.49 35.94,19.88 30.86,19.88 30.54,20.19 v30.54,20.89
SCK  (via drill 0.61)
  Top 0.254: v31.3,12.64 30.92,13.02 J1.7 | IC4.17 57.21,16.19 v57.21,16.7
  Bottom 0.254: v31.3,12.64 31.3,17.97 29.59,17.97 28.96,18.61 28.96,21.78 29.53,22.35 38.59,22.35 39.35,21.59 58.04,21.59 58.48,21.14 58.48,19.75 58.44,19.71 58.44,16.98 58.17,16.7 v57.21,16.7
SCL  (via drill 0.61)
  Top 0.254: TUBES.3 11.81,20.19 12.45,19.56 20.07,19.56 20.7,20.2 | 20.7,20.2 R26.2 | IC4.28 61.39,10.08 61.98,10.67 v61.98,11.3 | v37.85,16.7 IC2.16 37.85,23.05 37.53,23.37 25.46,23.37 25.15,23.05 25.15,20.51 24.83,20.19 24.19,20.19 24.19,20.2 20.7,20.2 | IC1.7 105.91,14.48 106.43,14.48 106.81,14.1 106.81,12.06 107.82,11.05 v107.82,10.54
  Bottom 0.254: v37.85,16.7 37.85,10.35 38.16,10.03 61.66,10.03 61.98,10.35 v61.98,11.3 61.98,13.21 62.1,13.34 98.17,13.34 100.2,11.3 107.57,11.3 107.82,11.05 v107.82,10.54
SDA  (via drill 0.61)
  Top 0.254: R27.2 18.16,20.51 17.84,20.19 13.08,20.19 12.76,20.51 12.76,22.42 12.45,22.73 | IC4.27 60.6,10.88 v60.71,10.99 | v39.12,16.7 IC2.15 39.12,23.75 38.87,24 v24.83,24 | v107.82,13.97 107.82,14.73 107.56,15 IC1.8
  Top 0.305: R27.2 v18.16,23.68 v18.16,23.69 | 12.45,22.73 TUBES.2
  Bottom 0.254: v39.12,16.7 39.12,11.3 39.43,10.99 v60.71,10.99 60.71,13.59 60.96,13.84 101.35,13.84 101.6,14.1 107.7,14.1 v107.82,13.97 | v24.83,24 18.48,24
  Bottom 0.305: v18.16,23.69 18.48,24
TX  (via drill 0.61)
  Top 0.254: J1.6 29.65,19.94 30.92,19.94 v31.81,20.83 | IC4.31 63.78,7.62 64.29,7.62 64.34,7.57 65.23,7.57 v65.53,7.87
  Bottom 0.254: v31.81,20.83 36.58,20.83 36.96,20.45 36.96,9.89 37.45,9.4 63.56,9.4 65.09,7.87 v65.53,7.87
VBUS  (via drill 0.61)
  Top 0.254: v100.33,29.08 100.26,29.02 R3.2 98.32,28.97 C17.2
  Top 0.61: IC5.4 106.29,29.34
  Top 0.813: 106.29,29.34 v106.43,29.21 R13.1
  Bottom 0.254: 110.67,27.05 110.67,25.2 110.63,25.16
  Bottom 0.813: v100.33,29.08 100.46,29.21 v106.43,29.21 109.98,29.21 110.67,28.52 110.67,27.05 110.8,26.92 110.8,7.55 109.73,6.48 97.41,6.48 95.25,8.64 87.88,8.64 80.77,1.52 70.1,1.52 69.6,2.03 SV1.4
VCC  (via drill 0.61)
  Top 0.254: R11.1 107.04,23.24 106.93,23.12 106.93,23.5 | 106.93,23.5 C13.2 | 103.76,28.19 106.55,28.19 106.93,27.82 106.93,23.5 | v101.35,27.05 IC5.1 | FUS1.1 107.26,33.66
  Top 0.61: IC5.6 IC5.5 | IC5.5 103.76,28.19 IC5.2 IC5.1 | IC5.5 103.76,32.89
  Top 0.813: 103.76,32.89 104.52,33.66 107.26,33.66

### Text on the board
tNames: www.steamclock.ch | Mark 1.5.1